# Altium schematic sheet Comms.SchDoc
size A
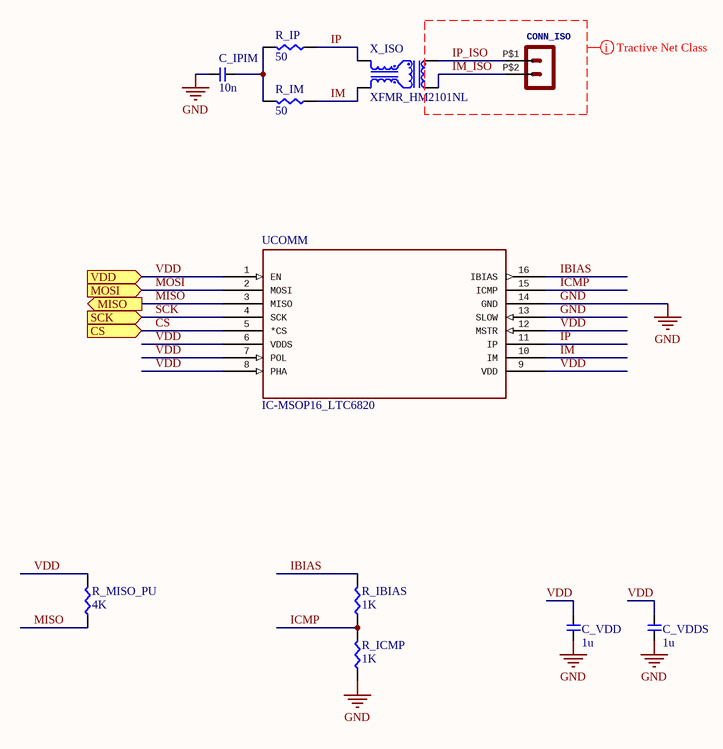
[diagram p0: Comms.SchDoc]

## Parts
C_IPIM  10n  [CAP-0603]
C_VDD  1u  [CAP-0603]
C_VDDS  1u  [CAP-0603]
CONN_ISO  (no value)  [43650-0224]
R_IBIAS  1K  [RES-0603]
R_ICMP  1K  [RES-0603]
R_IM  50  [RES-0603]
R_IP  50  [RES-0603]
R_MISO_PU  4K  [RES-0603]
UCOMM  IC-MSOP16_LTC6820  [MSOP16]
X_ISO  XFMR_HM2101NL  [HM2101]

## Ports
CS (in), MISO (out), MOSI (in), SCK (in), VDD (in)

## Nets
GND: C_IPIM.2 C_VDD.1 C_VDDS.1 R_ICMP.1 UCOMM.13(SLOW) UCOMM.14(GND)
CS: UCOMM.5(*CS) ; port CS
IBIAS: R_IBIAS.2 UCOMM.16(IBIAS)
ICMP: R_IBIAS.1 R_ICMP.2 UCOMM.15(ICMP)
IM: R_IM.1 UCOMM.10(IM) X_ISO.6
IM_ISO: CONN_ISO.P$2 X_ISO.1
IP: R_IP.1 UCOMM.11(IP) X_ISO.4
IP_ISO: CONN_ISO.P$1 X_ISO.3
MISO: R_MISO_PU.1 UCOMM.3(MISO) ; port MISO
MOSI: UCOMM.2(MOSI) ; port MOSI
SCK: UCOMM.4(SCK) ; port SCK
VDD: C_VDD.2 C_VDDS.2 R_MISO_PU.2 UCOMM.1(EN) UCOMM.6(VDDS) UCOMM.7(POL) UCOMM.8(PHA) UCOMM.9(VDD) UCOMM.12(MSTR) ; port VDD
NetC_IPIM_1: C_IPIM.1 R_IM.2 R_IP.2

## Layout directives
net class Tractive: IM_ISO, IP_ISO

## Library data of the parts
C_IPIM C_VDD C_VDDS = CAP-0603
CONN_ISO = POS2_43650-0224: GateName_1: G$1; SymbolName_1: HEADER_POS2; DeviceSetName: HEADER_POS2_?; DeviceName: 43650-0224; LibraryName: MOLEX Micro-Fit; Package: 43650-0224
R_IBIAS R_ICMP R_IM R_IP R_MISO_PU = RES-0603